# Altium schematic sheet [13] USB3.0_Connector3&4.SchDoc
size A3; DocumentNumber: 13; SheetNumber: 13; SheetTotal: 16
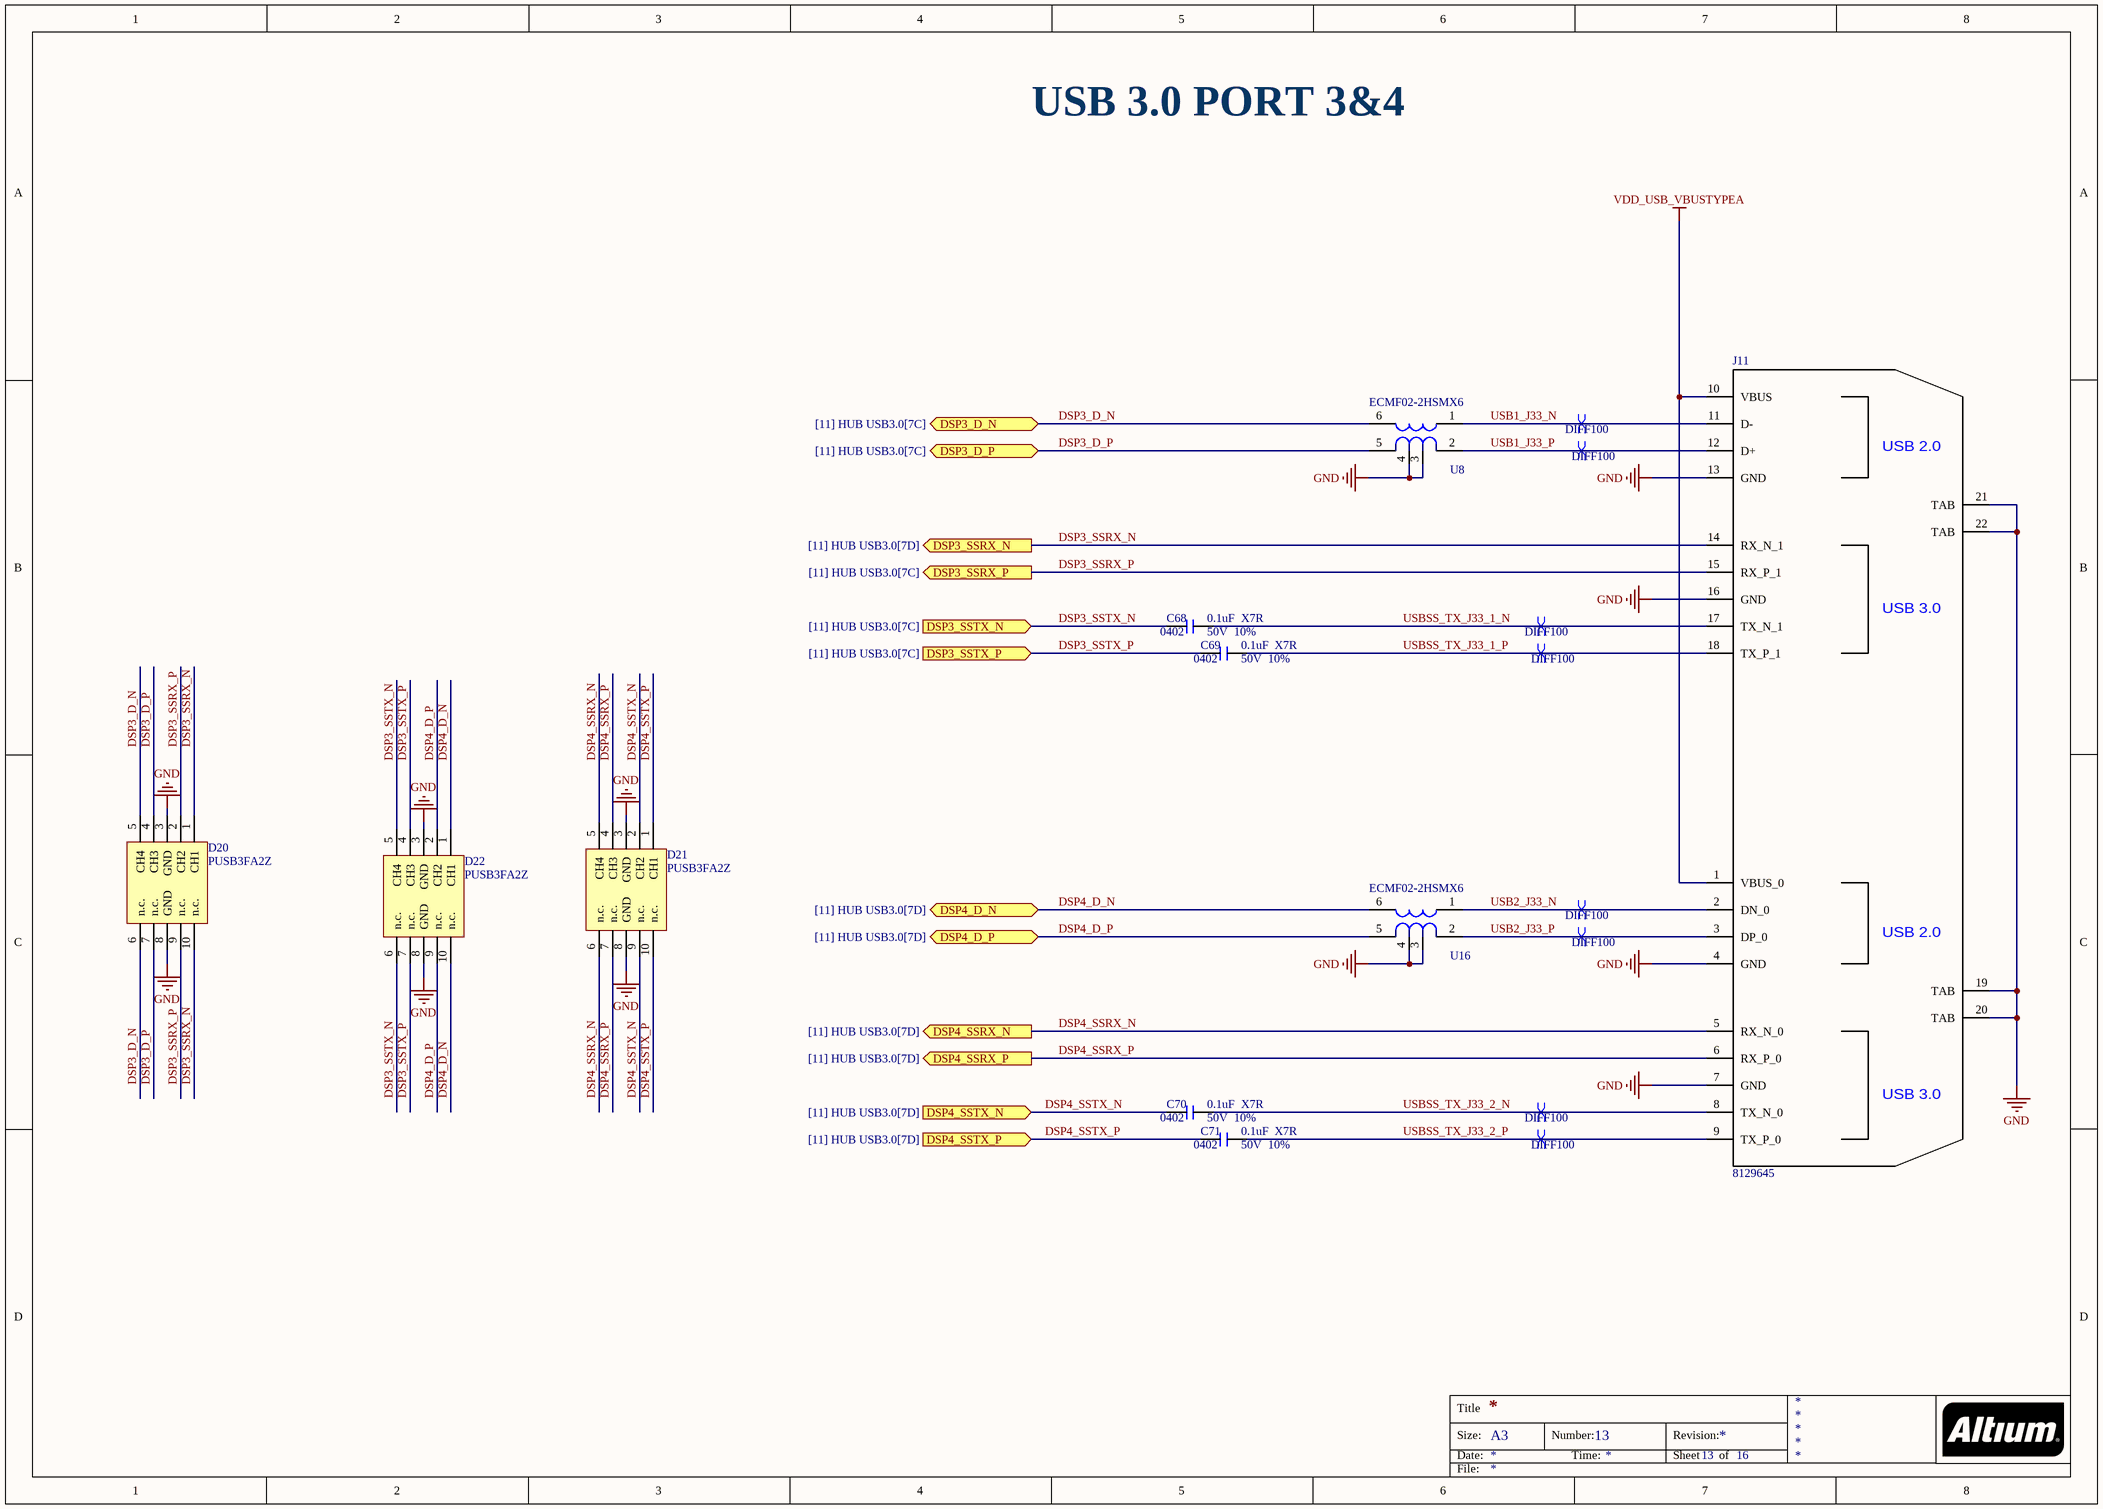
[diagram p0: [13] USB3.0_Connector3&4.SchDoc]

## Parts
C68  0.1uF  Case/Package: 0402  Tolerance: 10%  Dielectric: X7R  Voltage: 50V  [C0402M]
C69  0.1uF  Case/Package: 0402  Tolerance: 10%  Dielectric: X7R  Voltage: 50V  [C0402M]
C70  0.1uF  Case/Package: 0402  Tolerance: 10%  Dielectric: X7R  Voltage: 50V  [C0402M]
C71  0.1uF  Case/Package: 0402  Tolerance: 10%  Dielectric: X7R  Voltage: 50V  [C0402M]
D20  PUSB3FA2Z  [SON50P100X50-10N]
D21  PUSB3FA2Z  [SON50P100X50-10N]
D22  PUSB3FA2Z  [SON50P100X50-10N]
J11  Supplier Part Number 1: 8129645  [Molex_48406-0003_0]  (hidden comment: 48406-0003)
U8  ECMF02-2HSMX6  [SON50P150X55-6N]
U16  ECMF02-2HSMX6  [SON50P150X55-6N]

## Ports
DSP3_D_N (bidir, see [11] HUB USB3.0[7C]), DSP3_D_P (bidir, see [11] HUB USB3.0[7C]), DSP3_SSRX_N (out, see [11] HUB USB3.0[7D]), DSP3_SSRX_P (out, see [11] HUB USB3.0[7C]), DSP3_SSTX_N (in, see [11] HUB USB3.0[7C]), DSP3_SSTX_P (in, see [11] HUB USB3.0[7C]), DSP4_D_N (bidir, see [11] HUB USB3.0[7D]), DSP4_D_P (bidir, see [11] HUB USB3.0[7D]), DSP4_SSRX_N (out, see [11] HUB USB3.0[7D]), DSP4_SSRX_P (out, see [11] HUB USB3.0[7D]), DSP4_SSTX_N (in, see [11] HUB USB3.0[7D]), DSP4_SSTX_P (in, see [11] HUB USB3.0[7D])

## Nets
GND: D20.3(GND) D20.8(GND) D21.3(GND) D21.8(GND) D22.3(GND) D22.8(GND) J11.4(GND) J11.7(GND) J11.13(GND) J11.16(GND) J11.19(TAB) J11.20(TAB) J11.21(TAB) J11.22(TAB) U8.3 U8.4 U16.3 U16.4
VDD_USB_VBUSTYPEA: J11.1(VBUS_0) J11.10(VBUS)
DSP3_D_N: D20.5(CH4) D20.6(n.c.) U8.6 ; port DSP3_D_N
DSP3_D_P: D20.4(CH3) D20.7(n.c.) U8.5 ; port DSP3_D_P
DSP3_SSRX_N: D20.1(CH1) D20.10(n.c.) J11.14(RX_N_1) ; port DSP3_SSRX_N
DSP3_SSRX_P: D20.2(CH2) D20.9(n.c.) J11.15(RX_P_1) ; port DSP3_SSRX_P
DSP3_SSTX_N: C68.1 D22.5(CH4) D22.6(n.c.) ; port DSP3_SSTX_N
DSP3_SSTX_P: C69.1 D22.4(CH3) D22.7(n.c.) ; port DSP3_SSTX_P
DSP4_D_N: D22.1(CH1) D22.10(n.c.) U16.6 ; port DSP4_D_N
DSP4_D_P: D22.2(CH2) D22.9(n.c.) U16.5 ; port DSP4_D_P
DSP4_SSRX_N: D21.5(CH4) D21.6(n.c.) J11.5(RX_N_0) ; port DSP4_SSRX_N
DSP4_SSRX_P: D21.4(CH3) D21.7(n.c.) J11.6(RX_P_0) ; port DSP4_SSRX_P
DSP4_SSTX_N: C70.1 D21.2(CH2) D21.9(n.c.) ; port DSP4_SSTX_N
DSP4_SSTX_P: C71.1 D21.1(CH1) D21.10(n.c.) ; port DSP4_SSTX_P
USB1_J33_N: J11.11(D-) U8.1
USB1_J33_P: J11.12(D+) U8.2
USB2_J33_N: J11.2(DN_0) U16.1
USB2_J33_P: J11.3(DP_0) U16.2
USBSS_TX_J33_1_N: C68.2 J11.17(TX_N_1)
USBSS_TX_J33_1_P: C69.2 J11.18(TX_P_1)
USBSS_TX_J33_2_N: C70.2 J11.8(TX_N_0)
USBSS_TX_J33_2_P: C71.2 J11.9(TX_P_0)

## Layout directives
differential pair; differential pair class DIFF100; net class DIFF100: USB1_J33_N, USB1_J33_P, USB2_J33_N, USB2_J33_P, USBSS_TX_J33_1_N, USBSS_TX_J33_1_P, USBSS_TX_J33_2_N, USBSS_TX_J33_2_P

## Notes on the sheet
- USB 3.0 PORT 3&4
- Title
- Size:
- Date:
- A3
- Number:
- Time:
- Revision:
- Sheet
- of
- File:
- (in symbol 48406-0003) USB 2.0; USB 3.0

## Library data of the parts
C68-C71 = CAP_CER: CAP CER 0.1UF 50V X7R 0402; Manufacturer: Murata; Manufacturer Part Number: GRM155R71H104KE14D; Material: Ceramic; Capacitance: 100nF; Dissipation Factor: 0.025%; ComponentLink1URL: https://datasheet.ciiva.com/25741/cl10b104kb8nnnl-25741341.pdf?src-supplier=Digi-Key; ComponentLink1Description: https://datasheet.ciiva.com/25741/cl10b104kb8nnnl-25741341.pdf?src-supplier=Digi-Key; ComponentLink2URL: https://datasheet.ciiva.com/26838/getdatasheetpartid-357523-26838415.pdf?src-supplier=Verical; ComponentLink2Description: https://datasheet.ciiva.com/26838/getdatasheetpartid-357523-26838415.pdf?src-supplier=Verical; Supplier 1: Digi-Key; Supplier Part Number 1: 490-10700-1-ND; Stock 1: 2282266; Pricing 1: 1 = 0.10000, 10 = 0.04600, 100 = 0.02050, 500 = 0.01464, 1000 = 0.01150, 2500 = 0.01045, 5000 = 0.00961 (USD); RoHS: Yes; Mount: Surface Mount; Weight: 0.000212oz; Case Code (Metric): 1005; Case Code (Imperial): 0402; Dielectric Material: Ceramic; Min Operating Temperature: -55°C; Max Operating Temperature: 125°C; Packaging: Tape and Reel; Voltage Rating: 50V; Termination: SMD/SMT; Composition: Ceramic; Voltage Rating (DC): 50V; Package Quantity: 10000; Length: 1mm; Height: 0.5mm; Width: 0.5mm; Thickness: 0.022inch; Depth: 0.5mm; REACH SVHC: No SVHC; Lead Free: Lead Free; ComponentLink3URL: http://www.farnell.com/datasheets/2079156.pdf?src-supplier=Farnell; ComponentLink3Description: http://www.farnell.com/datasheets/2079156.pdf?src-supplier=Farnell; ComponentLink4URL: http://www.mouser.com/ds/2/281/c02e-2905.pdf?src-supplier=Mouser; ComponentLink4Description: http://www.mouser.com/ds/2/281/c02e-2905.pdf?src-supplier=Mouser; ComponentLink5URL: http://components.arrow.com/part/dataview/0323_07030614?src-supplier=Arrow+Europe; ComponentLink5Description: http://components.arrow.com/part/dataview/0323_07030614?src-supplier=Arrow+Europe; ComponentLink6URL: https://search.murata.co.jp/Ceramy/image/img/A01X/G101/ENG/GRM155R71H104KE14-01.pdf?src-supplier=Digi-Key; ComponentLink6Description: https://search.murata.co.jp/Ceramy/image/img/A01X/G101/ENG/GRM155R71H104KE14-01.pdf?src-supplier=Digi-Key; ComponentLink7URL: http://psearch.en.murata.com/capacitor/product/GRM155R71H104KE14%23.pdf?src-supplier=Avnet; ComponentLink7Description: http://psearch.en.murata.com/capacitor/product/GRM155R71H104KE14%23.pdf?src-supplier=Avnet; ComponentLink8URL: http://www.farnell.com/datasheets/2079156.pdf?src-supplier=Element14; ComponentLink8Description: http://www.farnell.com/datasheets/2079156.pdf?src-supplier=Element14; ComponentLink9URL: http://www.farnell.com/datasheets/2079156.pdf?src-supplier=Newark; ComponentLink9Description: http://www.farnell.com/datasheets/2079156.pdf?src-supplier=Newark
D20-D22 = PUSB3FA2Z: ESD Suppressors / TVS Diodes PUSB3FA2 XSON10; Manufacturer 1: Nexperia; Supplier 1: Digi-Key; Manufacturer Part Number 1: PUSB3FA2Z; RoHS: No; Stock 1: 355; Pricing 1: 1=0.33000, 10=0.25600, 100=0.15390, 500=0.14250, 1000=0.09690, 2000=0.08921 (USD); ComponentLink1URL: https://assets.nexperia.com/documents/data-sheet/PUSB3FA2.pdf?src-supplier=Digi-Key; ComponentLink1Description: https://assets.nexperia.com/documents/data-sheet/PUSB3FA2.pdf?src-supplier=Digi-Key; Supplier Part Number 1: 1727-7813-1-ND
J11 = 48406-0003: Conn USB 3.0 Type A F 18 POS 2mm/2.5mm Solder RA Thru-Hole 18 Terminal 2 Port USB 3.0 Tray; Manufacturer 1: Molex; Supplier 1: RSComponents; Manufacturer Part Number 1: 48406-0003; Stock 1: 201; Pricing 1: 1=2.79200, 50=2.48300, 100=2.24100, 250=1.96000, 500=1.89300 (USD); RoHS: Yes
U8 U16 = ECMF02-2AMX6: CMC 200MA 2LN SMD ESD; Manufacturer 1: STMicroelectronics; Number of Lines: 2; Max Current Rating: 100mA; DC Resistance (DCR): 9R; Frequency: 6GHz; Supplier 1: Digi-Key; Supplier Part Number 1: 497-14544-1-ND; Manufacturer Part Number 1: ECMF02-2HSMX6; Stock 1: 3; Pricing 1: 1=0.71000, 10=0.62100, 25=0.57720, 50=0.48820, 100=0.44390, 250=0.41724, 500=0.37286, 1000=0.30184 (USD); RoHS: Yes; Mount: Surface Mount; Number of Pins: 6; Min Operating Temperature: -40°C; Max Operating Temperature: 85°C; Package Quantity: 3000; Packaging: Tape and Reel; Current: 100mA; Termination: SMD/SMT; Length: 0.063inch; Width: 0.053inch; Height: 0.022inch; Radiation Hardening: No; REACH SVHC: No SVHC; Lead Free: Lead Free; RoHS Compliant: Yes; ComponentLink1URL: https://datasheet.ciiva.com/29369/dm00092023-29369570.pdf?src-supplier=Digi-Key; ComponentLink1Description: https://datasheet.ciiva.com/29369/dm00092023-29369570.pdf?src-supplier=Digi-Key; ComponentLink2URL: https://datasheet.ciiva.com/29369/dm00092023-29369574.pdf?src-supplier=Digi-Key; ComponentLink2Description: https://datasheet.ciiva.com/29369/dm00092023-29369574.pdf?src-supplier=Digi-Key; ComponentLink3URL: https://datasheet.ciiva.com/46423/1867258-46423658.pdf?src-supplier=Element14; ComponentLink3Description: https://datasheet.ciiva.com/46423/1867258-46423658.pdf?src-supplier=Element14